# Altium schematic sheet Sensor&Screen.SchDoc
size A; SheetNumber: 3; SheetTotal: 3
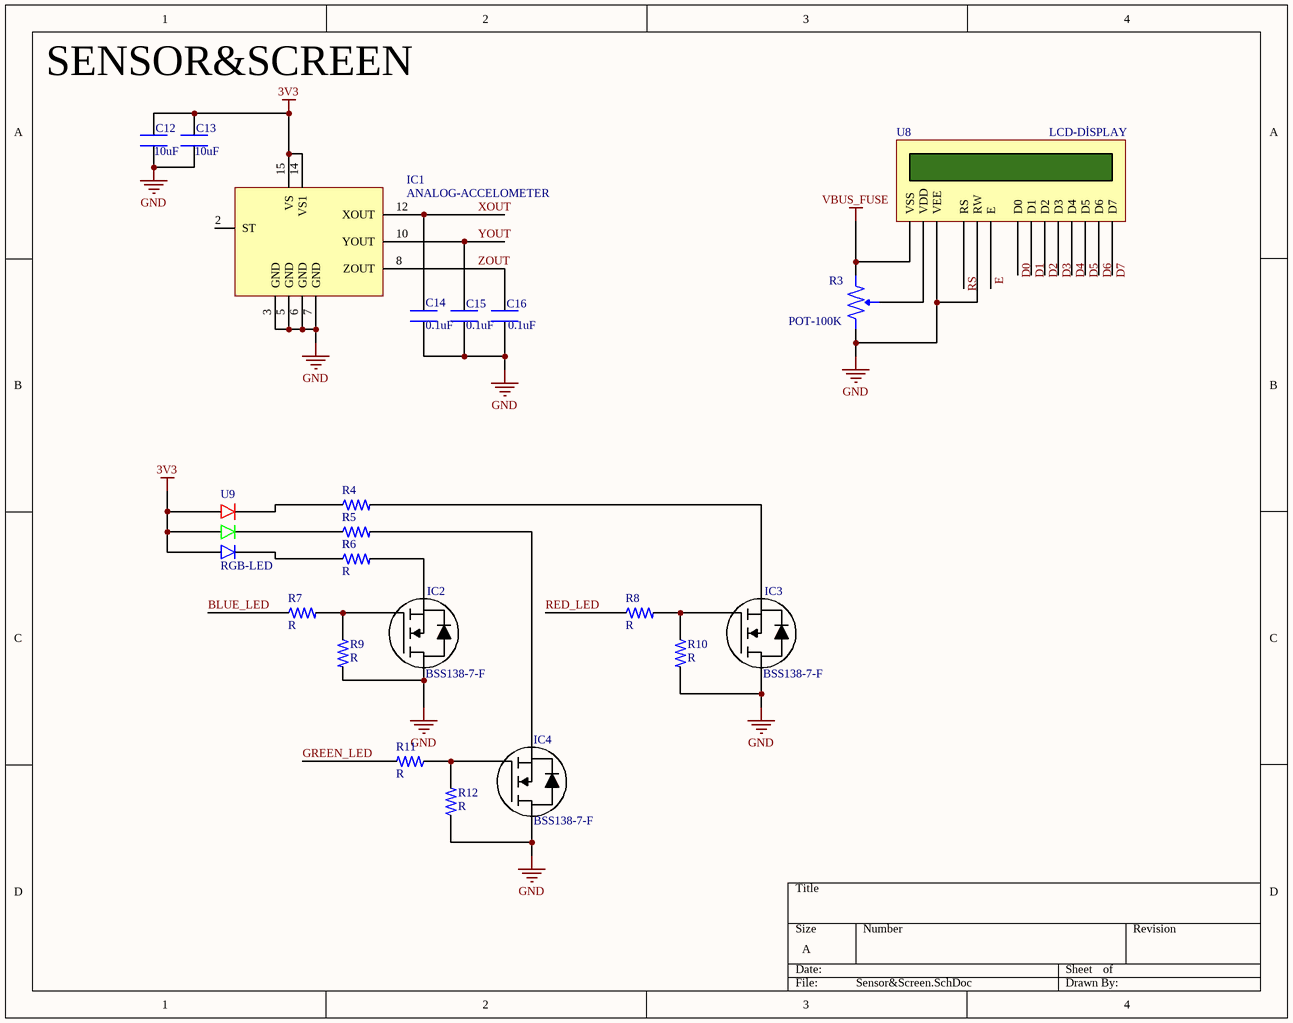
[diagram p0: Sensor&Screen.SchDoc]

## Parts
C12  10uF  [PCBComponent_1]
C13  10uF  [PCBComponent_1]
C14  0.1uF  [PCBComponent_1]
C15  0.1uF  [PCBComponent_1]
C16  0.1uF  [PCBComponent_1]
IC1  ANALOG-ACCELOMETER  [PCBComponent_1]
IC2  BSS138-7-F  [PCBComponent_1]
IC3  BSS138-7-F  [PCBComponent_1]
IC4  BSS138-7-F  [PCBComponent_1]
R3  POT-100K  [PCBComponent_1]
R4  R  [PCBComponent_1]
R5  R  [PCBComponent_1]
R6  R  [PCBComponent_1]
R7  R  [PCBComponent_1]
R8  R  [PCBComponent_1]
R9  R  [PCBComponent_1]
R10  R  [PCBComponent_1]
R11  R  [PCBComponent_1]
R12  R  [PCBComponent_1]
U8  LCD-DİSPLAY  [PCBComponent_1]
U9  RGB-LED  [PCBComponent_1]

## Nets
3V3: C12.2 C13.2 IC1.14(VS1) IC1.15(VS) U9.4(R) U9.5(G) U9.6(B)
GND: C12.1 C13.1 C14.1 C15.1 C16.1 IC1.3(GND) IC1.5(GND) IC1.6(GND) IC1.7(GND) IC2.3(SOURCE) IC3.3(SOURCE) IC4.3(SOURCE) R3.3 R9.2 R10.2 R12.1 U8.3(VEE) U8.5(RW)
VBUS_FUSE: R3.1 U8.1(VSS)
BLUE_LED: R7.1
D0: U8.7(D0)
D1: U8.8(D1)
D2: U8.9(D2)
D3: U8.10(D3)
D4: U8.11(D4)
D5: U8.12(D5)
D6: U8.13(D6)
D7: U8.14(D7)
E: U8.6(E)
GREEN_LED: R11.2
RED_LED: R8.1
RS: U8.4(RS)
XOUT: C14.2 IC1.12(XOUT)
YOUT: C15.2 IC1.10(YOUT)
ZOUT: C16.2 IC1.8(ZOUT)
NetIC2_1: IC2.1(GATE) R7.2 R9.1
NetIC2_2: IC2.2(DRAİN) R6.2
NetIC3_1: IC3.1(GATE) R8.2 R10.1
NetIC3_2: IC3.2(DRAİN) R4.2
NetIC4_1: IC4.1(GATE) R11.1 R12.2
NetIC4_2: IC4.2(DRAİN) R5.2
NetR3_2: R3.2 U8.2(VDD)
NetR4_1: R4.1 U9.3
NetR5_1: R5.1 U9.2
NetR6_1: R6.1 U9.1

Not connected (* = marked no-connect by the designer): IC1 2(ST)

## Notes on the sheet
- SENSOR&SCREEN

## Library data of the parts
C12-C16 = 1206-CAPACİTOR
IC1 = ADXL33X
IC2-IC4 = Component_1
R3 = L-KLS4-R0902N-B100K-L25-
R4-R12 = 1206-RESİSTOR
U8 = 0802A
U9 = FYLS-5050NRGB